# EAGLE design H1FR0 (EAGLE 8.6.3)

## Sheet 1 of 2
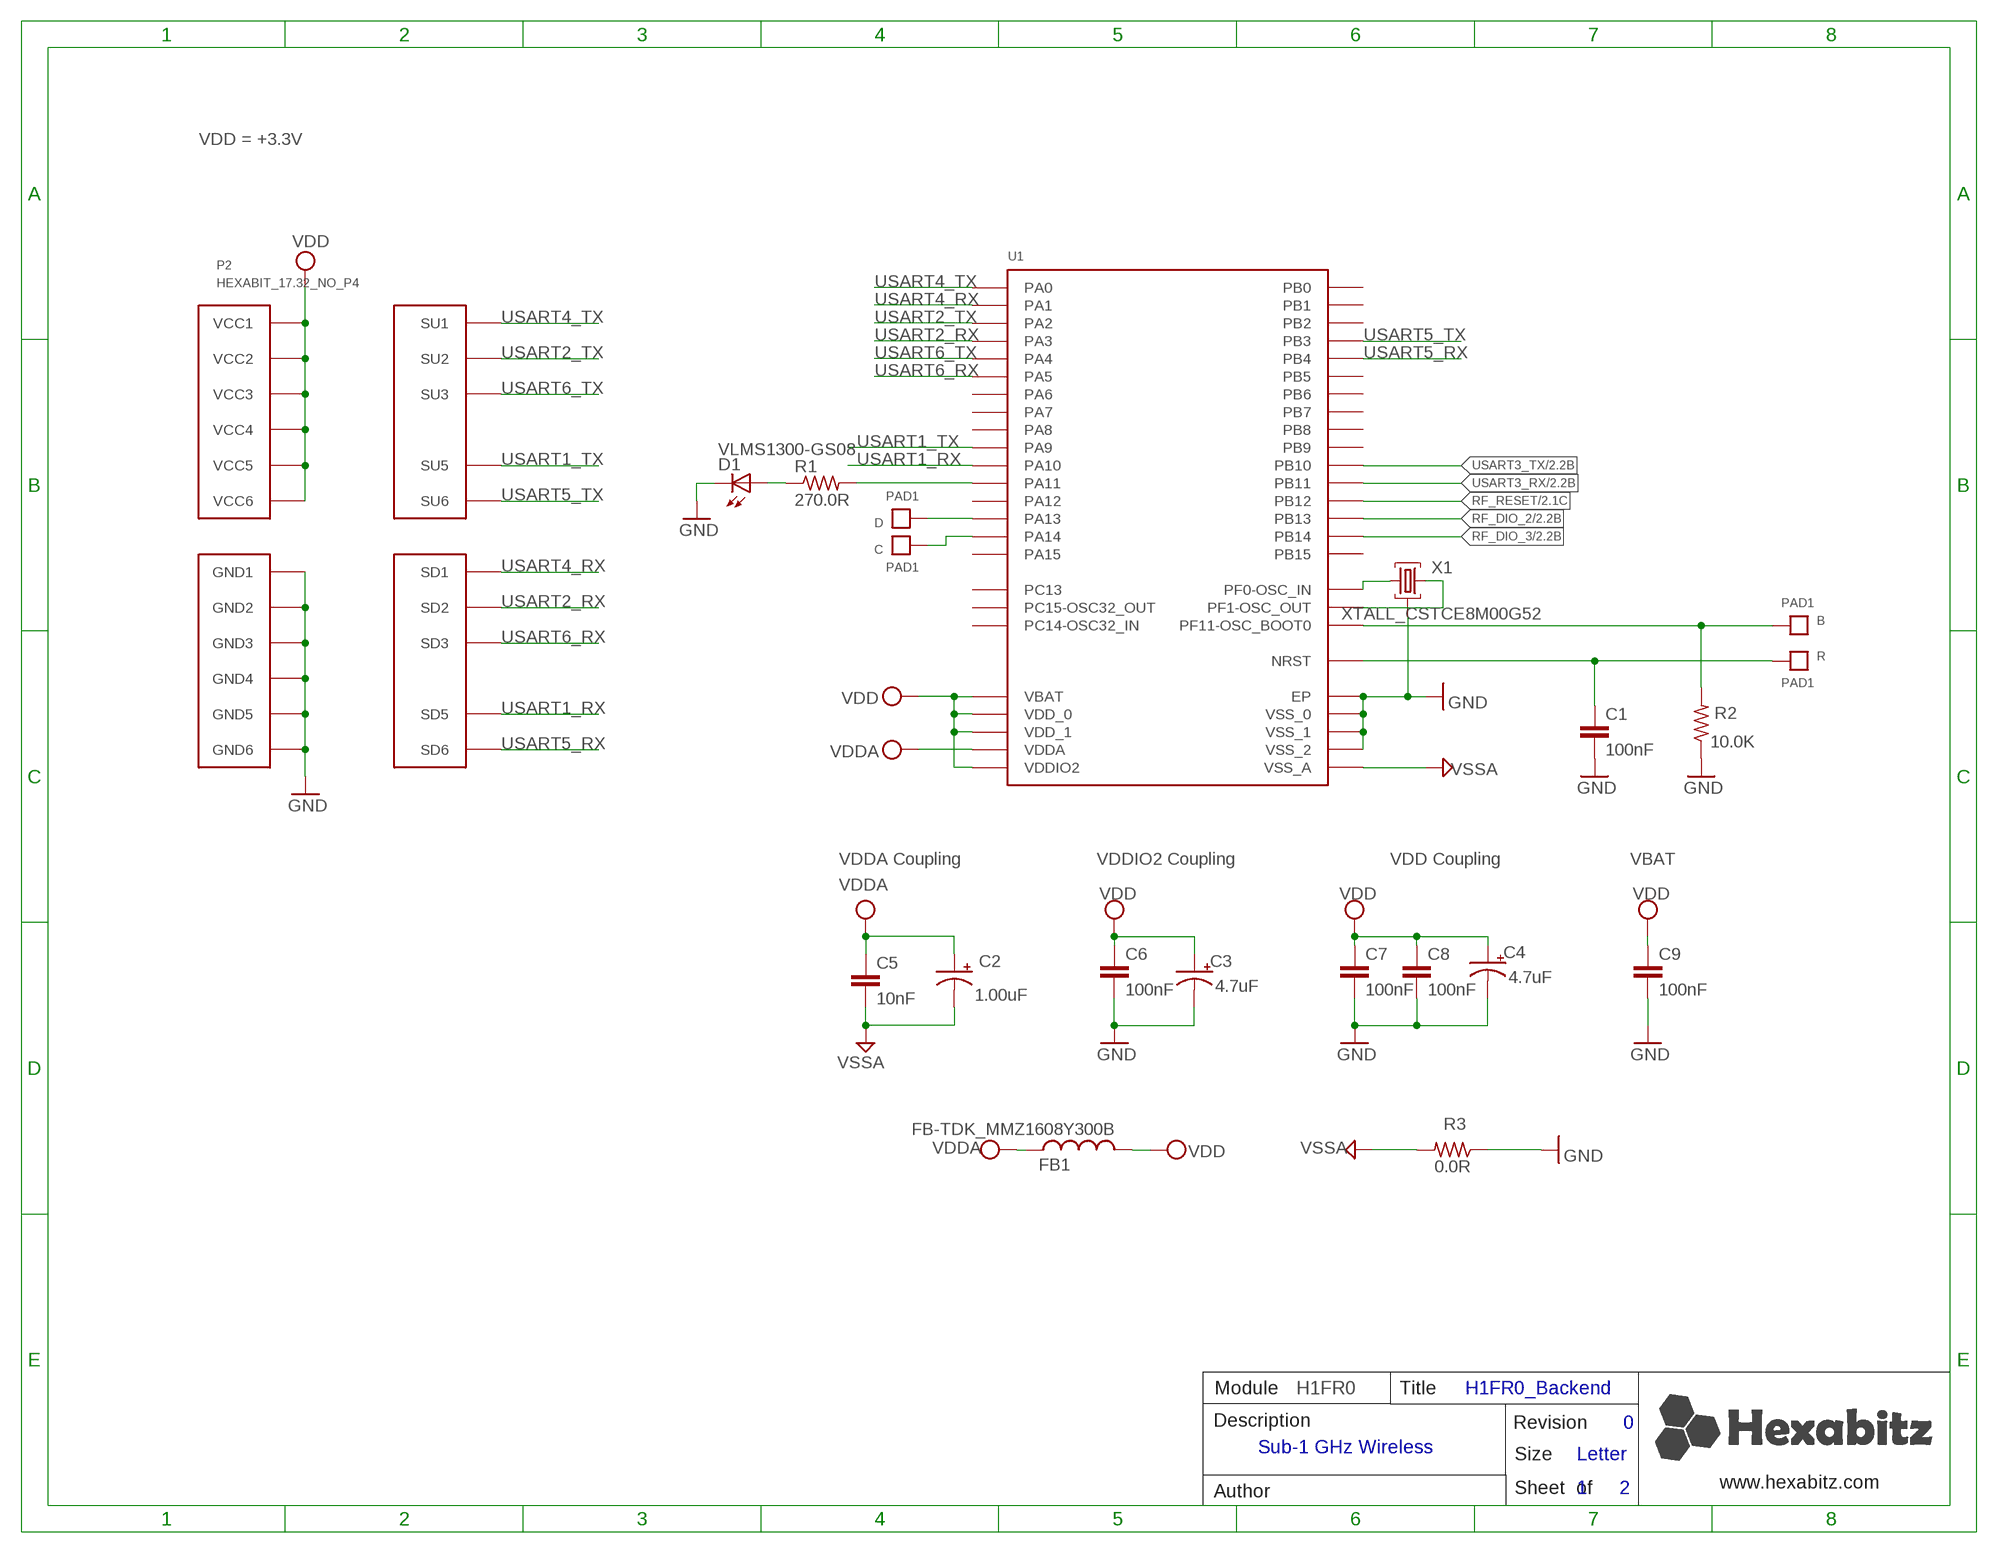
[diagram p0: schematic, sheet 1]

### Parts
B  PAD1  [PAD1]
C  PAD1  [PAD1]
C1  100nF  C-0603  [C-0603]
C2  1.00uF  C-0805  [C-0805]
C3  4.7uF  C-0805  [C-0805]
C4  4.7uF  C-0805  [C-0805]
C5  10nF  C-0603  [C-0603]
C6  100nF  C-0603  [C-0603]
C7  100nF  C-0603  [C-0603]
C8  100nF  C-0603  [C-0603]
C9  100nF  C-0603  [C-0603]
D  PAD1  [PAD1]
D1  VLMS1300-GS08  [VLMS1300-GS08]
FB1  FB-TDK_MMZ1608Y300B  [FB-TDK_MMZ1608Y300B]
P2  HEXABIT_17.32_NO_P4  [HEXABIT_17.32_NO_P4]
R  PAD1  [PAD1]
R1  270.0R  R-0603  [R-0603]
R2  10.0K  R-0603  [R-0603]
R3  0.0R  R-0603  [R-0603]
U1  STM32F091CBU6  [STM32F091CBU6]
X1  XTALL_CSTCE8M00G52  [XTALL_CSTCE8M00G52]

### Nets
B: B.P$1 B.P$2 R2.2 U1.P$44(PF11-OSC_BOOT0)
GND: C1.2 C3.2(-) C4.2(-) C6.2 C7.2 C8.2 C9.2 D1.C P2.7(GND1) P2.8(GND2) P2.9(GND3) P2.10(GND4) P2.11(GND5) P2.12(GND6) R2.1 R3.1 U1.EP U1.P$23(VSS_0) U1.P$35(VSS_1) U1.P$47(VSS_2) X1.P$2 ; also sheet 2
N$1: D.P$1 D.P$2 U1.P$34(PA13)
N$2: C.P$1 C.P$2 U1.P$37(PA14)
N$8: R1.2 U1.P$32(PA11)
N$10: D1.A R1.1
N$14: U1.P$5(PF0-OSC_IN) X1.P$1
N$15: U1.P$6(PF1-OSC_OUT) X1.P$3
R: C1.1 R.P$1 R.P$2 U1.P$7(NRST)
RF_DIO_2: U1.P$26(PB13) ; also sheet 2
RF_DIO_3: U1.P$27(PB14) ; also sheet 2
RF_RESET: U1.P$25(PB12) ; also sheet 2
USART1_RX: P2.23(SD5) U1.P$31(PA10)
USART1_TX: P2.17(SU5) U1.P$30(PA9)
USART2_RX: P2.20(SD2) U1.P$13(PA3)
USART2_TX: P2.14(SU2) U1.P$12(PA2)
USART3_RX: U1.P$22(PB11) ; also sheet 2
USART3_TX: U1.P$21(PB10) ; also sheet 2
USART4_RX: P2.19(SD1) U1.P$11(PA1)
USART4_TX: P2.13(SU1) U1.P$10(PA0)
USART5_RX: P2.25(SD6) U1.P$40(PB4)
USART5_TX: P2.18(SU6) U1.P$39(PB3)
USART6_RX: P2.21(SD3) U1.P$15(PA5)
USART6_TX: P2.15(SU3) U1.P$14(PA4)
VDD: C3.1(+) C4.1(+) C6.1 C7.1 C8.1 C9.1 FB1.2 P2.1(VCC1) P2.2(VCC2) P2.3(VCC3) P2.4(VCC4) P2.5(VCC5) P2.6(VCC6) U1.P$1(VBAT) U1.P$24(VDD_0) U1.P$36(VDDIO2) U1.P$48(VDD_1) ; also sheet 2
VDDA: C2.1(+) C5.1 FB1.1 U1.P$9(VDDA)
VSSA: C2.2(-) C5.2 R3.2 U1.P$8(VSS_A)
Unconnected: U1.P$2(PC13) U1.P$3(PC14-OSC32_IN) U1.P$4(PC15-OSC32_OUT) U1.P$16(PA6) U1.P$17(PA7) U1.P$18(PB0) U1.P$19(PB1) U1.P$20(PB2) U1.P$28(PB15) U1.P$29(PA8) U1.P$33(PA12) U1.P$38(PA15) U1.P$41(PB5) U1.P$42(PB6) U1.P$43(PB7) U1.P$45(PB8) U1.P$46(PB9)

### Notes on the sheet
- VDD = +3.3V
- VDDA Coupling | VDDIO2 Coupling | VDD Coupling | VBAT
- Module | H1FR0 | Title | H1FR0_Backend
- Description | Revision | 0
- Sub-1 GHz Wireless
- Size | Letter
- www.hexabitz.com
- Author | Sheet  of | 1 | 2
- C:/Users/Admin/Desktop/logodraft.bmp

## Sheet 2 of 2
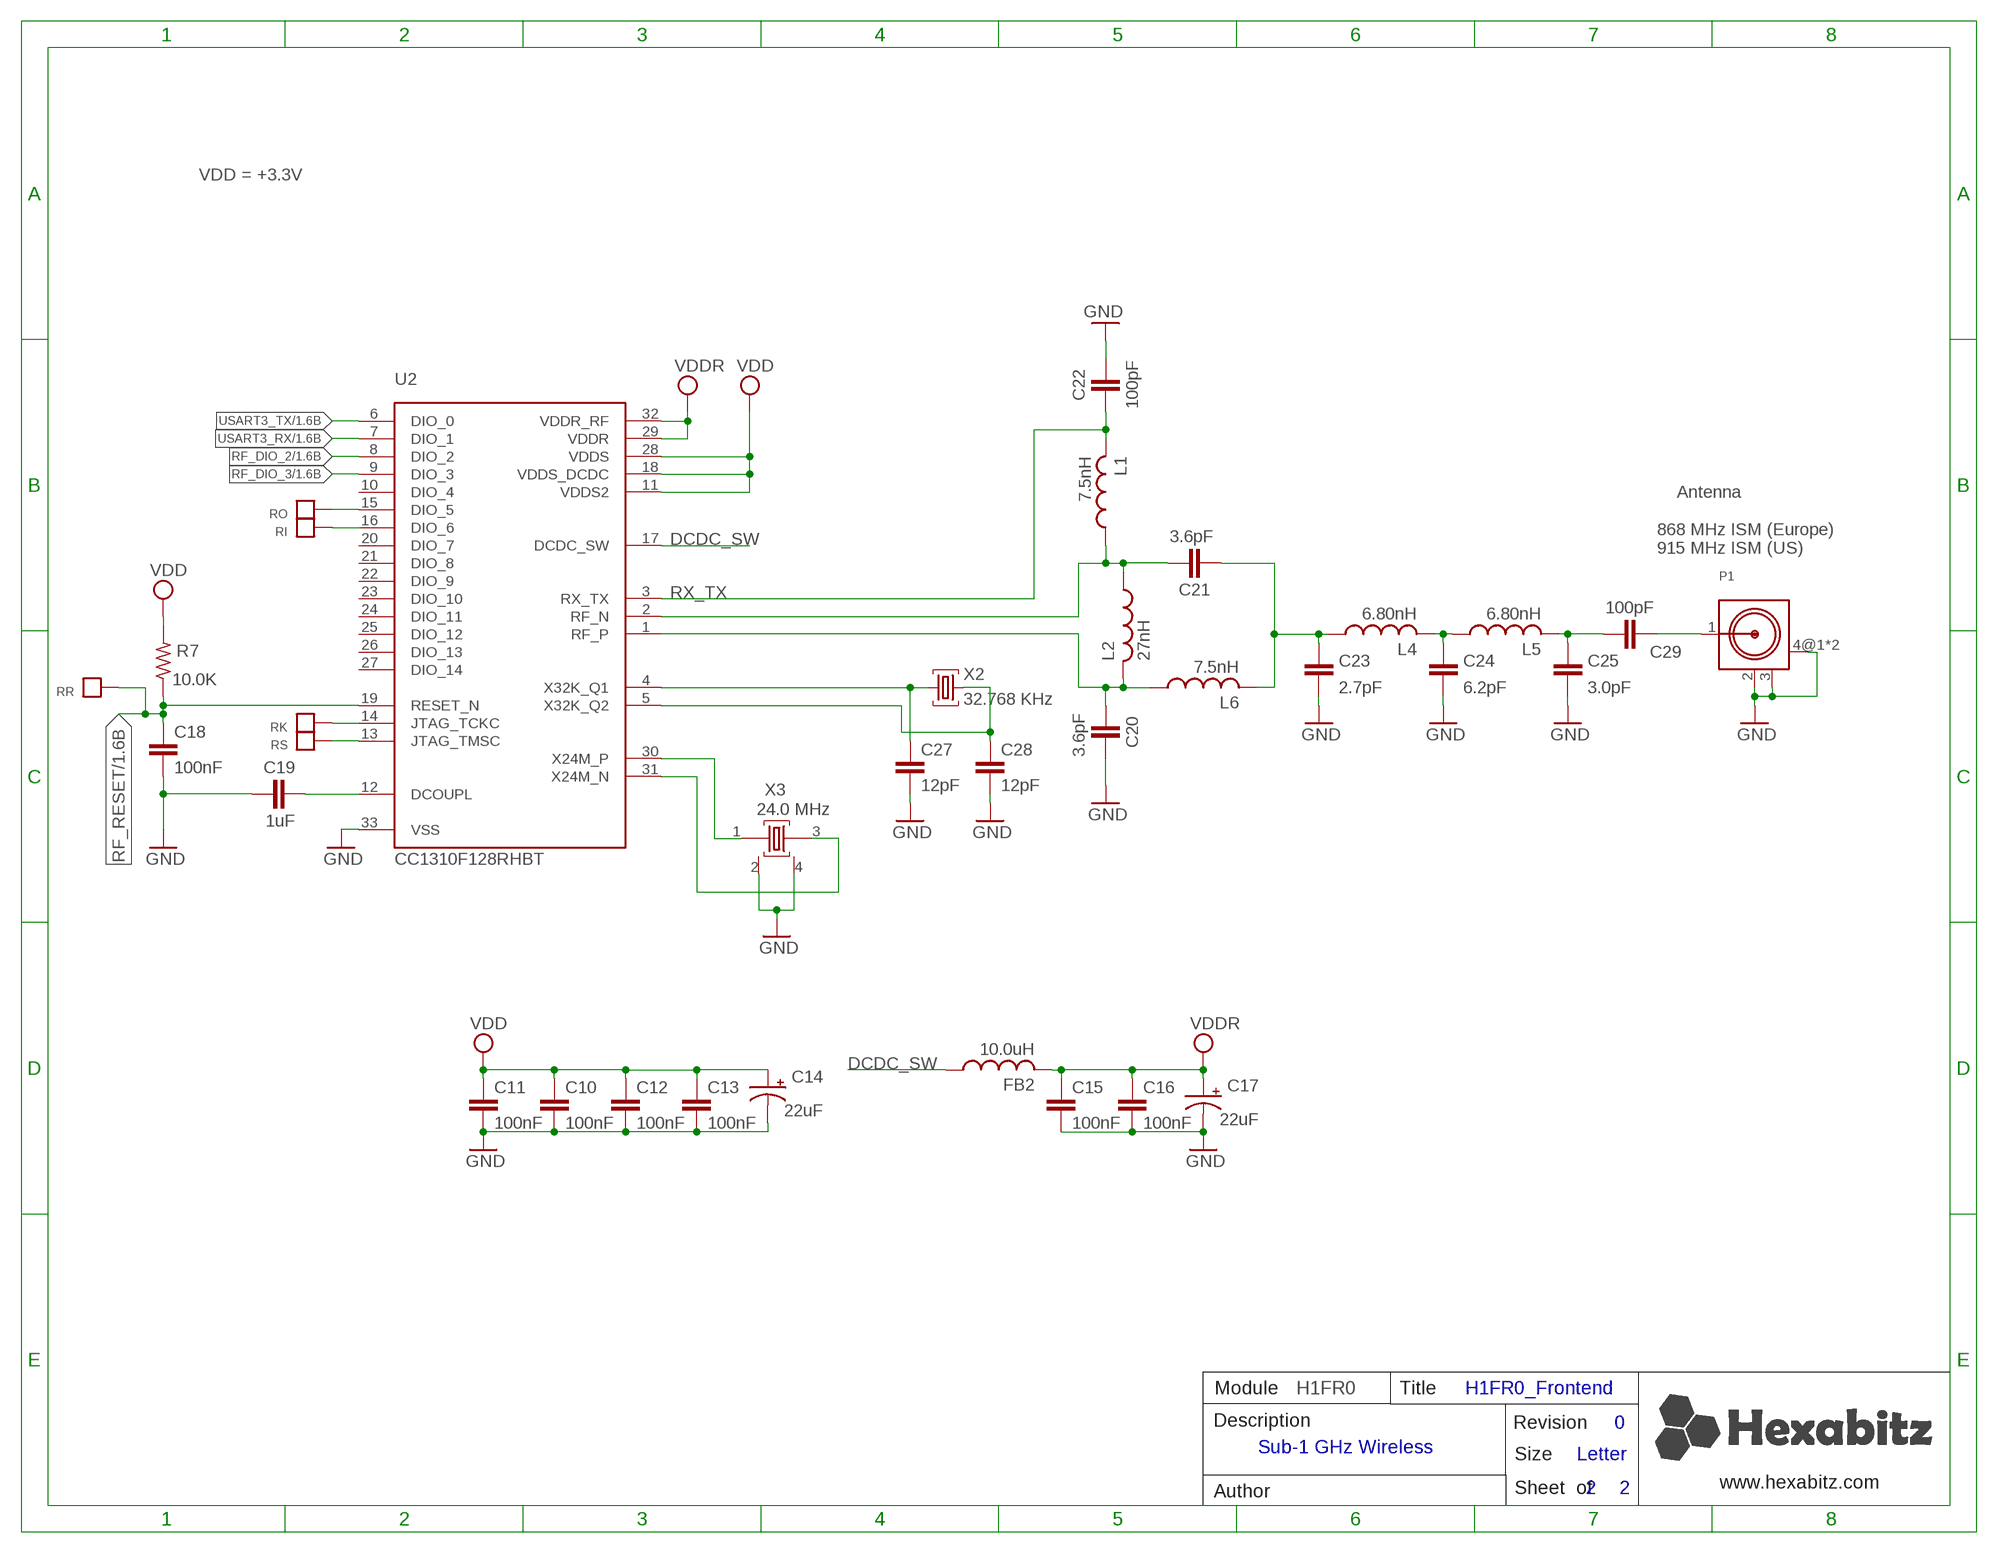
[diagram p1: schematic, sheet 2]

### Parts
C10  100nF  C-0402  [C-0402]
C11  100nF  C-0402  [C-0402]
C12  100nF  C-0402  [C-0402]
C13  100nF  C-0402  [C-0402]
C14  22uF  C-0805  [C-0805]
C15  100nF  C-0402  [C-0402]
C16  100nF  C-0402  [C-0402]
C17  22uF  C-0805  [C-0805]
C18  100nF  C-0402  [C-0402]
C19  1uF  C-0603  [C-0603]
C20  3.6pF  C-0402  [C-0402]
C21  3.6pF  C-0402  [C-0402]
C22  100pF  C-0402  [C-0402]
C23  2.7pF  C-0402  [C-0402]
C24  6.2pF  C-0402  [C-0402]
C25  3.0pF  C-0402  [C-0402]
C27  12pF  C-0603  [C-0603]
C28  12pF  C-0603  [C-0603]
C29  100pF  C-0402  [C-0402]
FB2  10.0uH  FB-0805  [FB-0805]
L1  7.5nH  IND-0402  [IND-0402]
L2  27nH  IND-0402  [IND-0402]
L4  6.80nH  IND-0402  [IND-0402]
L5  6.80nH  IND-0402  [IND-0402]
L6  7.5nH  IND-0402  [IND-0402]
P1  5-1814400-1  [5-1814400-1]
R7  10.0K  R-0603  [R-0603]
RI  PAD4  [PAD4]
RK  PAD4  [PAD4]
RO  PAD4  [PAD4]
RR  PAD4  [PAD4]
RS  PAD4  [PAD4]
U2  CC1310F128RHBT  [CC1310F128RHBT]
X2  32.768 KHz  XTALL_FC-12M  [XTALL_FC-12M]
X3  24.0 MHz  XTALL_TXS-3225-24.0000M  [XTALL_TXS-3225-24.0000M]

### Nets
DCDC_SW: FB2.1 U2.17(DCDC_SW)
GND: C10.2 C11.2 C12.2 C13.2 C14.2(-) C15.2 C16.2 C17.2(-) C18.2 C19.1 C20.2 C22.2 C23.1 C24.1 C25.1 C27.2 C28.2 P1.2 P1.3 P1.4@1 P1.4@2 U2.33(VSS) X3.2 X3.4 ; also sheet 1
N$3: RO.P$1 U2.15(DIO_5)
N$5: C21.1 C23.2 L4.1 L6.2
N$6: C19.2 U2.12(DCOUPL)
N$7: RK.P$1 U2.14(JTAG_TCKC)
N$9: RS.P$1 U2.13(JTAG_TMSC)
N$11: C24.2 L4.2 L5.1
N$12: C25.2 C29.2 L5.2
N$13: C29.1 P1.1
N$16: C27.1 U2.4(X32K_Q1) X2.P$2
N$17: C28.1 U2.5(X32K_Q2) X2.P$1
N$18: U2.30(X24M_P) X3.1
N$19: U2.31(X24M_N) X3.3
N$20: RI.P$1 U2.16(DIO_6)
N$22: C21.2 L1.1 L2.1 U2.2(RF_N)
N$24: C20.1 L2.2 L6.1 U2.1(RF_P)
RF_DIO_2: U2.8(DIO_2) ; also sheet 1
RF_DIO_3: U2.9(DIO_3) ; also sheet 1
RF_RESET: C18.1 R7.1 RR.P$1 U2.19(RESET_N) ; also sheet 1
RX_TX: C22.1 L1.2 U2.3(RX_TX)
USART3_RX: U2.7(DIO_1) ; also sheet 1
USART3_TX: U2.6(DIO_0) ; also sheet 1
VDD: C10.1 C11.1 C12.1 C13.1 C14.1(+) R7.2 U2.11(VDDS2) U2.18(VDDS_DCDC) U2.28(VDDS) ; also sheet 1
VPP: C15.1 C16.1 C17.1(+) FB2.2 U2.29(VDDR) U2.32(VDDR_RF) ; supply symbol labelled VDDR
Unconnected: U2.10(DIO_4) U2.20(DIO_7) U2.21(DIO_8) U2.22(DIO_9) U2.23(DIO_10) U2.24(DIO_11) U2.25(DIO_12) U2.26(DIO_13) U2.27(DIO_14)

### Notes on the sheet
- VDD = +3.3V
- Antenna
  
  868 MHz ISM (Europe)
  915 MHz ISM (US)
- Module | H1FR0 | Title | H1FR0_Frontend
- Description | Revision | 0
- Sub-1 GHz Wireless
- Size | Letter
- www.hexabitz.com
- Author | Sheet  of | 2 | 2
- C:/Users/Admin/Desktop/logodraft.bmp

## Library data of the parts
B C D R = Hexabitz:PAD1
C1 C6 C8 = Hexabitz:C-0603: CAP CER 10% X7R 0603; CAPACITANCE: 100nF; MFN: KEMET; MPN: C0603C104K8RACTU; OCTOPART_URL: https://octopart.com/c0603c104k8ractu-kemet-145075?r=sp&s=9bS9ASSwSEqMCE9KBEQZ0g; TOLERANCE: 10%; VOLTAGE_RATING: 10V
C2 = Hexabitz:C-0805: Cap Tant Solid SMD 2012; CAPACITANCE: 1.00uF; MFN: Yageo; MPN: CC0805KKX7R7BB105; OCTOPART_URL: https://octopart.com/cc0805kkx7r7bb105-yageo-8376555?r=sp&s=YKl1wwtkROau_X5nniH2ig; TOLERANCE: 10%; VOLTAGE_RATING: 16V
C3 C4 = Hexabitz:C-0805: Cap Tant Solid SMD 2012; CAPACITANCE: 4.7uF; MFN: Murata; MPN: GRM21BC81E475KA12L; OCTOPART_URL: https://octopart.com/grm21bc81e475ka12l-murata-10331911?r=sp&s=RY3qZSD8T6mG6TC9CHI5qQ; TOLERANCE: 10%; VOLTAGE_RATING: 25V
C5 = Hexabitz:C-0603: CAP CER 10% X7R 0603; CAPACITANCE: 10nF; MFN: KEMET; MPN: C0603C103K5RACTU; OCTOPART_URL: https://octopart.com/c0603c103k5ractu-kemet-133094?r=sp&s=R_iPBxLnSmGqhkU2rIMFpg; TOLERANCE: 10%; VOLTAGE_RATING: 50V
C7 = Hexabitz:C-0603: CAP CER 10% X7R 0603; CAPACITANCE: 100nF; MFN: KEMET; MPN: C0603C104K8RACTU; OCTOPART_URL: https://octopart.com/c0603c104k8ractu-kemet-145075?r=sp&s=9bS9ASSwSEqMCE9KBEQZ0g; TOLERANCE: 10%; VOLTAGE_RATING: 10
C9 = Hexabitz:C-0603: CAP CER 10% X7R 0603; CAPACITANCE: 100nF; MFN: KEMET; MPN: C0603C104K8RACTU; OCTOPART_URL: https://octopart.com/c0603c104k8ractu-kemet-145075?r=sp&s=9bS9ASSwSEqMCE9KBEQZ0g; TOLERANCE: 10V; VOLTAGE_RATING: 10%
C10-C13 C15 C16 C18 = Hexabitz:C-0402: CAP CER 10% 0402; MFN: Murata; MPN: GRM155R70J104KA01D; OCTOPART_URL: https://octopart.com/grm155r70j104ka01d-murata-17930200; TOLERANCE: ±10%; VOLTAGE_RATING: 6.3 V
C14 C17 = Hexabitz:C-0805: Cap Tant Solid SMD 2012; CAPACITANCE: 22uF; MFN: Yageo; MPN: CC0805KKX5R5BB226; OCTOPART_URL: https://octopart.com/search?q=CC0805KKX5R5BB226&start=0; TOLERANCE: 10%; VOLTAGE_RATING: 6.3V
C19 = Hexabitz:C-0603: CAP CER 10% X7R 0603; CAPACITANCE: 1uF; MFN: Murata; MPN: GRM188R70J105KA01D; OCTOPART_URL: https://octopart.com/grm188r70j105ka01d-murata-197450; TOLERANCE: 10%; VOLTAGE_RATING: 6.3V
C20 = Hexabitz:C-0402: CAP CER 10% 0402; MFN: Murata; MPN: GRM1555C1H3R6CA01D; OCTOPART_URL: https://octopart.com/grm1555c1h3r6ca01d-murata-18814425; TOLERANCE: ±0.25pF; VOLTAGE_RATING: 50 V
C21 = Hexabitz:C-0402: CAP CER 10% 0402; MFN: Murata; MPN: GRM1555C1H3R6CA01D; OCTOPART_URL: https://octopart.com/grm1555c1h3r6ca01d-murata-18814425; TOLERANCE: ±0.25%; VOLTAGE_RATING: 50 V
C22 C29 = Hexabitz:C-0402: CAP CER 10% 0402; MFN: Murata; MPN: GRM1555C1H101JA01D; OCTOPART_URL: https://octopart.com/grm1555c1h101ja01d-murata-15197512; TOLERANCE: ±5%; VOLTAGE_RATING: 50V
C23 = Hexabitz:C-0402: CAP CER 10% 0402; MFN: Murata; MPN: GRM1555C1H2R7CA01D; OCTOPART_URL: https://octopart.com/search?q=GRM1555C1H2R7CA01D&start=0; TOLERANCE: ±0.25 pF; VOLTAGE_RATING: 50 V
C24 = Hexabitz:C-0402: CAP CER 10% 0402; MFN: Murata; MPN: GRM1555C1H6R2CA01D; OCTOPART_URL: https://octopart.com/search?q=GRM1555C1H6R2CA01D&start=0; TOLERANCE: ±0.25pF; VOLTAGE_RATING: 50 V
C25 = Hexabitz:C-0402: CAP CER 10% 0402; MFN: Murata; MPN: GRM1555C1H3R0CA01D; OCTOPART_URL: https://octopart.com/search?q=GRM1555C1H3R0CA01D&start=0; TOLERANCE: ±0.25 pF; VOLTAGE_RATING: 50 V
C27 C28 = Hexabitz:C-0603: CAP CER 10% X7R 0603; CAPACITANCE: 12pF; MFN: AVX; MPN: 06035A120JAT2A; OCTOPART_URL: https://octopart.com/06035a120jat2a-avx-194785; TOLERANCE: 5%; VOLTAGE_RATING: 50V
D1 = Hexabitz:VLMS1300-GS08: Red 0603 130° Clear 54 mcd 2 V Surface Mount ChipLED ; Octopart Url : http://octopart.com/vlms1300-gs08-vishay-21709201; MFN: Vishay; MPN: VLMS1300-GS08; OCTOPART_URL: https://octopart.com/vlms1300-gs08-vishay-21709201?r=sp&s=_gcP4_q8T1SC6PJQPTQ9yA
FB1 = Hexabitz:FB-TDK_MMZ1608Y300B: Ferrite Beads Multi-Layer 30Ohm 25% 100MHz 1.5A 50mOhm DCR 0603; MFN: TDK; MPN: MMZ1608Y300B; OCTOPART_URL: https://octopart.com/mmz1608y300b-tdk-368280?r=sp&s=cd9_2ZEqQ9q9UNBuQgHAiA
FB2 = Hexabitz:FB-0805: Ferrite Beads Multi-Layer 0805; MFN: Taiyo Yuden; MPN: CKS2125100M-T; OCTOPART_URL: http://octopart.com/cks2125100m-t-taiyo+yuden-18605517
L1 L6 = Hexabitz:IND-0402: Inductor - SMD 0402; INDUCTANCE: 7.5nH; MFN: Murata; MPN: LQG15HS7N5J02D; OCTOPART_URL: https://octopart.com/search?q=LQG15HS7N5J02D&start=0
L2 = Hexabitz:IND-0402: Inductor - SMD 0402; INDUCTANCE: 27nH; MFN: Murata; MPN: LQG15HS27NJ02D; OCTOPART_URL: https://octopart.com/search?q=LQG15HS27NJ02D&start=0
L4 L5 = Hexabitz:IND-0402: Inductor - SMD 0402; INDUCTANCE: 6.80nH; MFN: Murata; MPN: LQW15AN6N8G00D; OCTOPART_URL: https://octopart.com/lqw15an6n8g00d-murata-7896134
P1 = Hexabitz:5-1814400-1: CONN SMA JACK R/A 50 OHM PCB; MFN: TE Connectivity; MPN: 5-1814400-1; OCTOPART_URL: https://octopart.com/search?q=5-1814400-1&oq=5-1814400-1&start=0
P2 = Hexabitz:HEXABIT_17.32_NO_P4: HEXABIT CONNECTOR
R1 = Hexabitz:R-0603: Thick Film Resistors - SMD 0603; MFN: Yageo; MPN: RC0603FR-07270RL; OCTOPART_URL: https://octopart.com/search?q=RC0603FR-07270RL&start=0; RESISTANCE: 270.0 Ohm; TOLERANCE: 1%
R2 R7 = Hexabitz:R-0603: Thick Film Resistors - SMD 0603; MFN: Yageo; MPN: RC0603JR-0710KL; OCTOPART_URL: https://octopart.com/search?q=RC0603JR-0710KL&start=0; RESISTANCE: 10.0K Ohm; TOLERANCE: 5%
R3 = Hexabitz:R-0603: Thick Film Resistors - SMD 0603; MFN: Yageo; MPN: RC0603JR-070RL; OCTOPART_URL: https://octopart.com/rc0603jr-070rl-yageo-1241539?r=sp&s=X2NteqRjRNWrnx42Y0aliA; RESISTANCE: 0.0 Ohm
RI RK RO RR RS = Hexabitz:PAD4
U1 = Hexabitz:STM32F091CBU6: Description : ARM-based 32-bit MCU, CAN, 12 timers, ADC, DAC & Comm. Interface, 2 to 3.6 V, -40 to 85 degC, 48-Pin UFQFPN, RoHS, Tray ;Parameter : Ciiva URL : https://ciiva.com/part/STM32F091CBU6-20240708, CiivaID : 20240708, Clock Speed : 48000000.0 Hz, Lifecycle Status : Active, Mounting Style : Surface Mount, Number of Pins : 48, Octopart Url : https://octopart.com/stm32f091cbu6-stmicroelectronics-51988677, OctopartID : 5f4f955c32ec8088, RAM Memory Size : 32768 B, REACH SVHC Compliance : No SVHC, RoHS : Compliant,; MFN: STMicroelectronics; MPN: STM32F091CBU6; OCTOPART_URL: https://octopart.com/stm32f091cbu6-stmicroelectronics-51988677?r=sp&s=bU6fpgsrTZOxHyt7jkfh3w
U2 = Hexabitz:CC1310F128RHBT: Description : SimpleLink Sub-1 GHz Ultra-Low Power Wireless Microcontroller 32-VQFN -40 to 85 Parameter : Core Architecture : ARM Current - Receiving : 5.5 mA Current - Transmitting : 22.6 mA Data Bus Width : 32 b Data Rate : 50 kbps Density : 131072 B Frequency : 930 MHz Interface : I2C , SPI , UART , I2S Max Frequency : 1 GHz Max Operating Temperature : 85 °C Max Supply Voltage : 3.8 V Memory Size : 20 kB Memory Type : FLASH Min Operating Temperature : -40 °C Min Supply Voltage : 1.8 V Number of GPIO : 15 Number of Programmable I/O : 15 Number of Timers/Counters : 4 RAM Size : 20 kb Sensitivity : -124 dBm Watchdog Timer : Yes; MFN: Texas Instruments; MPN: CC1310F128RHBT; OCTOPART_URL: http://octopart.com/cc1310f128rhbt-texas+instruments-65758956
X1 = Hexabitz:XTALL_CSTCE8M00G52: MURATA CSTCE8M00G52-R0 RESONATOR, SMD, 8MHZ ; Octopart Url : https://octopart.com/cstce8m00g52-r0-murata-7145559; MFN: Murata; MPN: CSTCE8M00G52Z-R0; OCTOPART_URL: https://octopart.com/cstce8m00g52z-r0-murata-17755941?r=sp&s=JDnNJnrHQhyS8Zk4ofFWXw
X2 = Hexabitz:XTALL_FC-12M: CRYSTAL 32.7680KHZ 12.5PF SMD; MFN: EPSON; MPN: FC-12M 32.7680KA-A3; OCTOPART_URL: https://octopart.com/fc-12m+32.7680ka-a3-epson-44407702
X3 = Hexabitz:XTALL_TXS-3225-24.0000M: TSX-3225 Series 24 MHz ±10 ppm 9 pF -40 to +105°C Surface Mount Crystal Unit; MFN: EPSON; MPN: TSX-3225 24.0000MF20G-AC3; OCTOPART_URL: https://octopart.com/tsx-3225+24.0000mf20g-ac3-epson-44407675

## Board
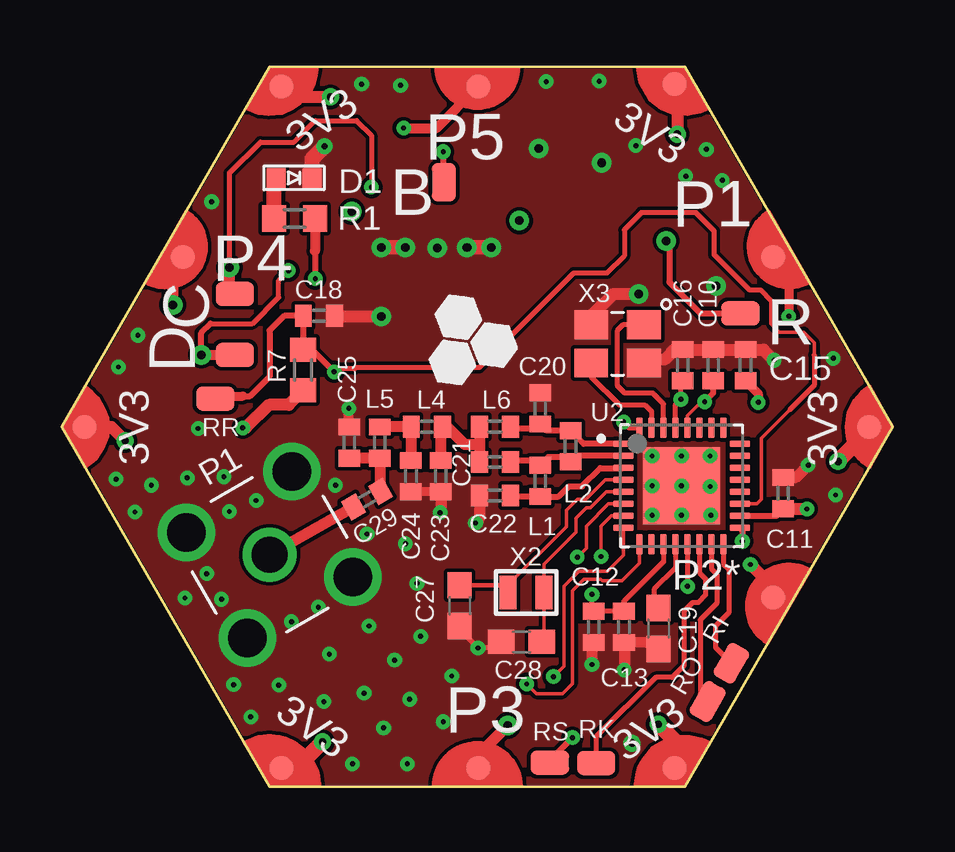
[diagram p2: board, top side]
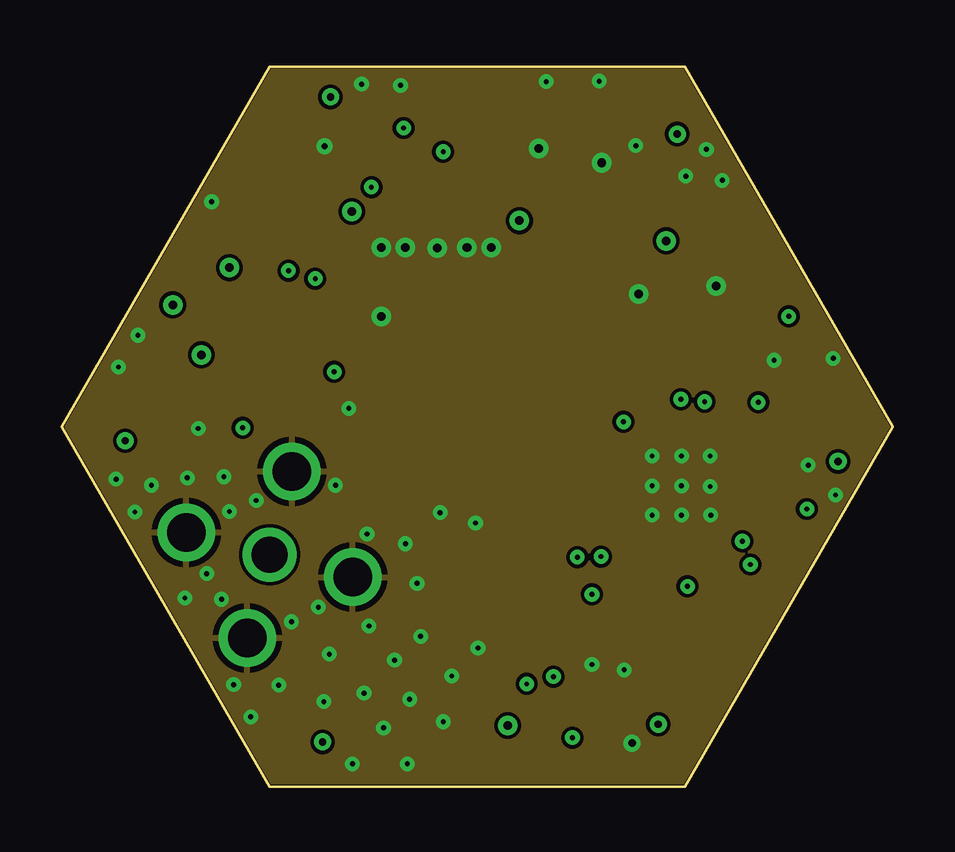
[diagram p3: board, inner layer Route2]
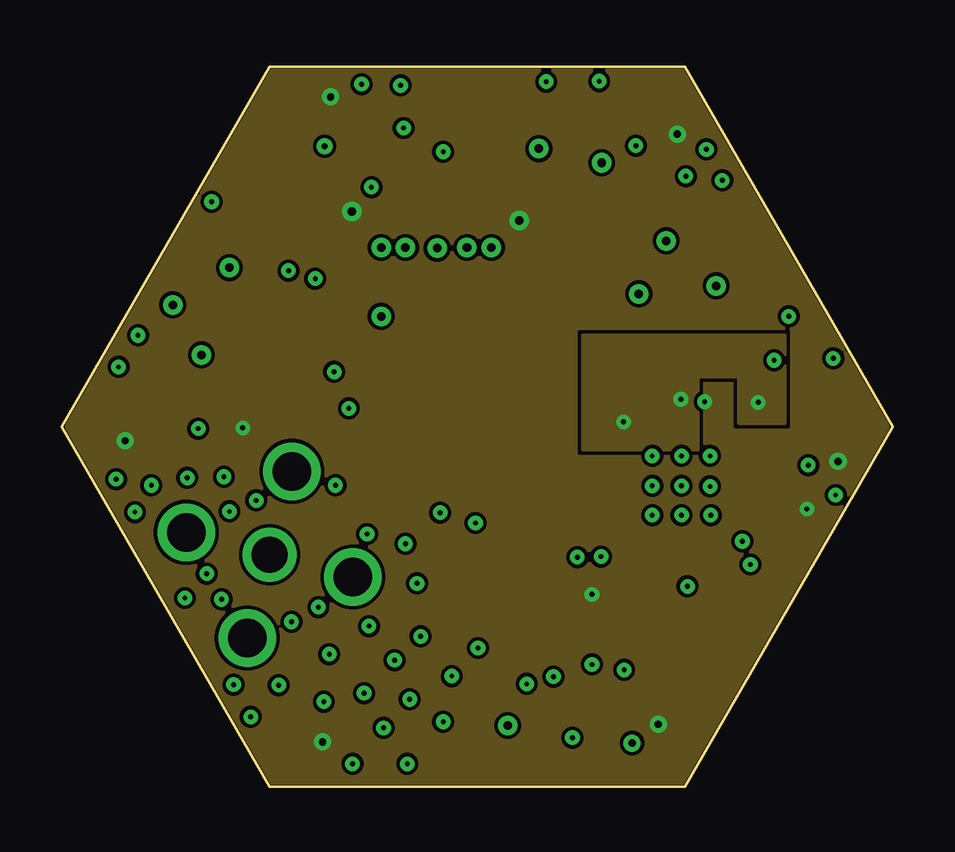
[diagram p4: board, inner layer Route15]
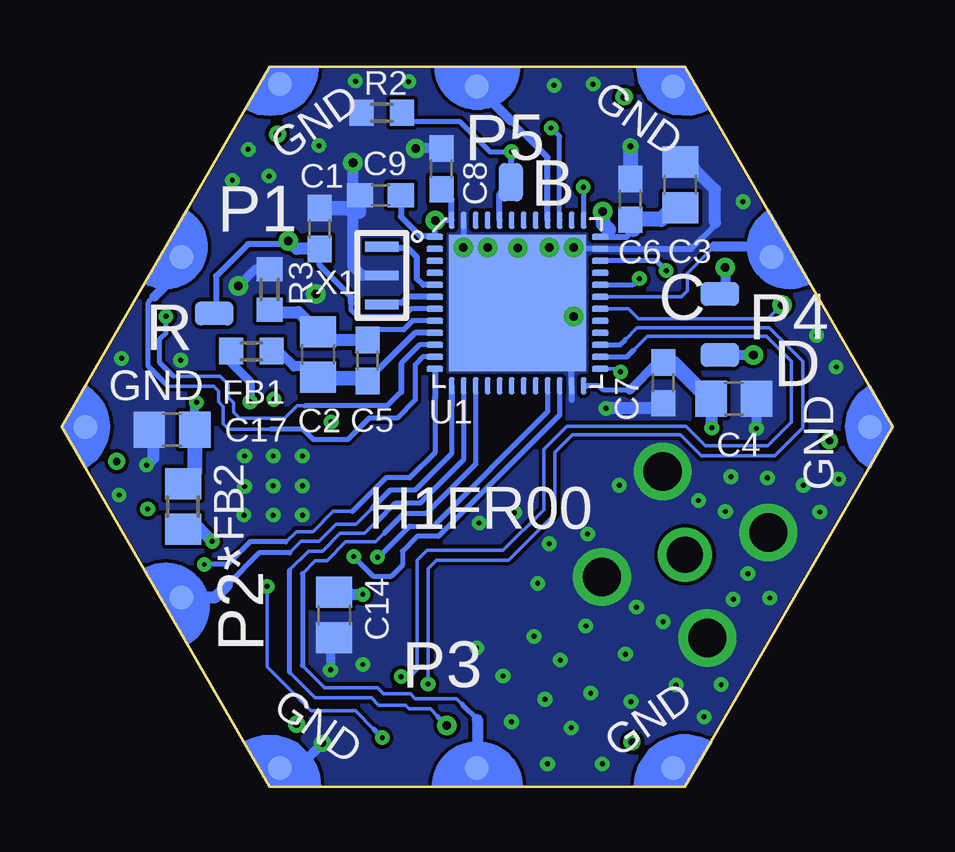
[diagram p5: board, bottom side, seen from below]

Size 34.64 x 30 mm. Coordinates in mm from the lower left corner, seen from the top.
Copper layers (1*2+15*16): Top 0.035mm / dielectric 0.175mm / Route2 0.035mm / dielectric 1.11mm / Route15 0.035mm / dielectric 0.175mm / Bottom 0.035mm
Design rules "default *": minimum track width 6mil, minimum drill 8mil, track to track 6mil, track to pad 6mil, pad to pad 6mil, via to via 6mil, smd to smd 0mil, copper to edge 1mil, drill to drill 8mil, minimum pad ring 10mil, minimum via ring 8mil, stop-mask expansion 2mil, vias tented up to drill 15mil, thermal gap 10mil

### Footprints (pad centres in the part's own frame; a part is rotated, then mirrored left to right if it is on the bottom)
PAD1 = smd 1.6 x 1: P$1 0,0 | smd 1.6 x 1 bottom: P$2 0,0
C-0603 = smd 1.1 x 1: 1 -0.85,0; 2 0.85,0
C-0805 = smd 1.3 x 1.5: 1 -0.95,0; 2 0.95,0
C-0402 = smd 0.7 x 0.9: 1 -0.65,0; 2 0.65,0
VLMS1300-GS08 = smd 0.8 x 0.8: A 0,0.75; C 0,-0.75
FB-TDK_MMZ1608Y300B = smd 1 x 1.1: 1 -0.85,0; 2 0.85,0
FB-0805 = smd 1.3 x 1.5: 1 -0.95,0; 2 0.95,0
IND-0402 = smd 0.7 x 0.9: 1 -0.65,0; 2 0.65,0
5-1814400-1 = drill 1.5: 1 0,0 | drill 1.6: 2 -2.54,-2.54; 3 2.54,-2.54; 4@1 -2.54,2.54; 4@2 2.54,2.54
HEXABIT_17.32_NO_P4 = smd 1 x 1: 1 8.23,14.28; 2 16.33,-0.02; 3 8.23,-14.22; 4 -8.17,-14.22; 5 -16.37,-0.02; 6 -8.17,14.18; 13 12.33,7.08; 14 12.33,-7.12; 15 0.03,-14.22; 17 -12.27,7.08; 18 0.03,14.18 | smd 1 x 1 bottom: 7 8.23,14.28; 8 16.33,-0.02; 9 8.23,-14.22; 10 -8.17,-14.22; 11 -16.37,-0.02; 12 -8.17,14.18; 19 12.33,7.08; 20 12.33,-7.12; 21 0.03,-14.22; 23 -12.27,7.08; 25 0.03,14.18
R-0603 = smd 1 x 1.1: 1 -0.85,0; 2 0.85,0
PAD4 = smd 1.6 x 1: P$1 0,0
STM32F091CBU6 = smd 5.7 x 5.7: EP 0,0 | smd 0.25 x 0.7: P$1 -2.75,-3.45; P$2 -2.25,-3.45; P$3 -1.75,-3.45; P$4 -1.25,-3.45; P$5 -0.75,-3.45; P$6 -0.25,-3.45; P$7 0.25,-3.45; P$8 0.75,-3.45; P$9 1.25,-3.45; P$10 1.75,-3.45; P$11 2.25,-3.45; P$12 2.75,-3.45; P$25 2.75,3.45; P$26 2.25,3.45; P$27 1.75,3.45; P$28 1.25,3.45; P$29 0.75,3.45; P$30 0.25,3.45; P$31 -0.25,3.45; P$32 -0.75,3.45; P$33 -1.25,3.45; P$34 -1.75,3.45; P$35 -2.25,3.45; P$36 -2.75,3.45 | smd 0.7 x 0.25: P$13 3.45,-2.75; P$14 3.45,-2.25; P$15 3.45,-1.75; P$16 3.45,-1.25; P$17 3.45,-0.75; P$18 3.45,-0.25; P$19 3.45,0.25; P$20 3.45,0.75; P$21 3.45,1.25; P$22 3.45,1.75; P$23 3.45,2.25; P$24 3.45,2.75; P$37 -3.45,2.75; P$38 -3.45,2.25; P$39 -3.45,1.75; P$40 -3.45,1.25; P$41 -3.45,0.75; P$42 -3.45,0.25; P$43 -3.45,-0.25; P$44 -3.45,-0.75; P$45 -3.45,-1.25; P$46 -3.45,-1.75; P$47 -3.45,-2.25; P$48 -3.45,-2.75
CC1310F128RHBT = smd 0.86 x 0.27: 1 -2.425,1.75; 2 -2.425,1.25; 3 -2.425,0.75; 4 -2.425,0.25; 5 -2.425,-0.25; 6 -2.425,-0.75; 7 -2.425,-1.25; 8 -2.425,-1.75; 17 2.425,-1.75; 18 2.425,-1.25; 19 2.425,-0.75; 20 2.425,-0.25; 21 2.425,0.25; 22 2.425,0.75; 23 2.425,1.25; 24 2.425,1.75 | smd 0.27 x 0.86: 9 -1.75,-2.425; 10 -1.25,-2.425; 11 -0.75,-2.425; 12 -0.25,-2.425; 13 0.25,-2.425; 14 0.75,-2.425; 15 1.25,-2.425; 16 1.75,-2.425; 25 1.75,2.425; 26 1.25,2.425; 27 0.75,2.425; 28 0.25,2.425; 29 -0.25,2.425; 30 -0.75,2.425; 31 -1.25,2.425; 32 -1.75,2.425 | smd 3.2 x 3.2: 33 0,0
XTALL_CSTCE8M00G52 = smd 1.4 x 0.4: P$1 0,1.2; P$2 0,0; P$3 0,-1.2
XTALL_FC-12M = smd 0.7 x 1.4: P$1 -0.75,0; P$2 0.75,0
XTALL_TXS-3225-24.0000M = smd 1.4 x 1.2: 1 -1.1,-0.8; 2 1.1,-0.8; 3 1.1,0.8; 4 -1.1,0.8

### Placement (x,y rotation side)
B  15.92,25.19 270 top
C  7.21,20.54 0 top
C1  23.89,23.25 90 bottom
C2  23.96,18.01 90 bottom
C3  8.86,25.08 90 bottom
C4  6.63,16.17 0 bottom
C5  21.89,17.76 90 bottom
C6  10.94,24.47 90 bottom
C7  9.57,16.83 270 bottom
C8  18.82,25.74 90 bottom
C9  21.36,24.65 180 bottom
C10  27.15,17.57 90 top
C11  30.07,12.23 90 top
C12  22.17,6.66 270 top
C13  23.43,6.66 270 top
C14  23.29,7.15 270 bottom
C15  28.5,17.57 90 top
C16  25.88,17.57 90 top
C17  30.05,14.87 180 bottom
C18  10.72,19.62 0 top
C19  24.88,6.59 90 top
C20  19.94,15.76 90 top
C21  18.06,13.53 0 top
C22  18.06,12.13 180 top
C23  15.8,12.94 90 top
C24  14.55,12.94 90 top
C25  11.99,14.34 270 top
C27  16.58,7.55 270 top
C28  19.16,6.03 180 top
C29  12.72,11.98 30 top
D  7.21,18 0 top
D1  9.67,25.36 90 top
FB1  26.74,18.15 180 bottom
FB2  29.59,11.67 90 bottom
L1  19.94,12.74 270 top
L2  21.21,14.19 90 top
L4  15.21,15 180 top
L5  13.26,14.34 270 top
L6  18.06,15 180 top
P1  8.66,9.67 300 top
P2  17.32,15 0 top
R  28.29,19.72 0 top
R1  9.7,23.67 0 top
R2  21.3,28.08 0 bottom
R3  25.98,20.71 270 bottom
R7  10.06,17.36 270 top
RI  27.91,5.14 60 top
RK  22.27,0.98 0 top
RO  26.92,3.54 60 top
RR  6.4,16.17 0 top
RS  20.34,1 0 top
U1  15.64,20.16 270 bottom
U2  25.83,12.54 0 top
X1  21.3,21.3 0 bottom
X2  19.35,8.09 180 top
X3  23.16,18.45 180 top

### Tracks (layer width: path | path; a pad name or v marks a point on that pad's centre or on a via)
B  (via drill 0.2 pad 0.41)
  Top 0.254: v15.9,26.45 15.9,25.21 B.P$1
  Bottom 0.203: R2.2 20.45,27.86 20.32,27.73 18.06,27.73 16.79,26.45 v15.9,26.45
  Bottom 0.254: v15.9,26.45 15.9,25.21 B.P$1 16.39,24.71 U1.P$44
DCDC_SW  (via drill 0.2 pad 0.41)
  Top 0.254: U2.17 28.37,10.67 v28.37,10.22
  Bottom 0.254: 28.92,10.77 FB2.1
  Bottom 0.508: v28.37,10.22 28.92,10.77
GND  (via drill 0.2 pad 0.41, 0.25 pad 0.51, 0.3 pad 0.61, 0.36 pad 0.81)
  Top 0.203: C27.2 16.86,6.26 v17.34,5.78 18.03,5.78 18.29,6.03 C28.2
  Top 0.381: C23.1 C24.1
  Top 0.406: C25.1 11.96,14.99 v11.96,15.76
  Top 0.457: C23.1 15.8,11.44 v15.77,11.42 | C22.2 17.41,11.15 v17.24,10.99 | C11.2 30.59,12.88 v31.11,13.4 | v23.44,4.87 23.44,5.97 C13.2 24.38,6.02 C19.1 | C12.2 22.09,5.97 v22.09,5.09
  Top 0.508: X3.2 22.06,19.61 22.98,20.54 v24.05,20.54 | X3.4 24.4,17.79 25.12,17.79 25.63,18.3 25.71,18.21 C10.2 C15.2 29.24,18.21 v29.69,17.77 | C18.2 11.39,19.6 v13.31,19.6
  Top 0.61: v13.31,22.47 v14.32,22.47 | v17.9,22.47 v16.89,22.47
  Top 0.635: D1.C 10.43,26.16 v10.95,26.68
  Bottom 0.254: U1.P$47 17.89,22.41 13.31,20.64 | 13.39,16.1 U1.P$23 13.39,18.16 13.56,21.86 15.01,18.38 14.42,20.64 | v13.31,22.47 13.32,22.41 U1.P$35 8.39,22.41 7.41,23.38 7.41,23.51 | v14.32,22.47 14.63,22.44
  Bottom 0.356: X1.P$2 22.12,21.3
  Bottom 0.381: R3.1 26.58,21.57 v27.28,20.87 | 23.06,5.97 23.39,5.97 C13.2 23.43,4.88 v23.44,4.87 | 23.92,1.67 v23.77,1.82
  Bottom 0.406: C8.2 19.99,26.59 19.99,26.58 | v22.5,26 22.45,26 | P2.9 24.81,0.78 23.92,1.67 | C4.2 v5.69,14.92
  Bottom 0.457: 22.12,21.3 22.5,21.68 22.5,23.84 22.76,24.09 | C1.2 22.54,24.05 22.5,24.09 v22.5,26 | 17.89,22.41 17.71,22.41 v17.9,22.47 | v16.89,22.47 16.41,22.44 | 30.82,13.69 v31.11,13.4 | C14.2 23.06,5.97
  Bottom 0.508: 7.41,23.51 7.41,24.88 8.33,25.8 | C7.2 9.79,15.76 v11.96,15.76 | 30.82,13.69 30.82,14.7 C17.2
  Bottom 0.61: C3.2 8.33,25.8 | 22.25,23.97 22.25,24.09 22.5,24.09 22.76,24.09 23.32,24.09 C1.2 | 14.42,20.64 13.31,20.64 15.64,21.3 | v15.64,22.44 14.63,22.44
  Bottom 0.635: v10.95,26.68 C6.2
  other vias: 19.89,26.58 25.83,12.54 25.83,13.78 24.61,13.78 24.61,12.54 24.61,11.32 25.83,11.32 27.05,11.32 27.02,12.51 27.02,13.78 6.98,11.47 8.1,11.93 6.04,8.88 6.65,7.81 9.57,6.87 10.69,7.48 11.4,12.56 12.72,10.53 14.32,10.12 14.81,8.47 2.26,12.82 3.05,11.44 5.13,7.86 7.16,4.26 7.87,2.91 9.04,4.23 11.15,5.53 10.92,3.54 13.87,5.27 12.8,6.69 14.5,3.65 14.96,6.26 6.75,12.92 5.23,12.87 3.73,12.56 12.6,3.9 15.9,2.71 13.41,2.45 12.11,0.95 14.4,0.95 16.25,4.61 2.36,17.49 3.17,18.81 6.25,24.37 12.49,29.27 14.12,29.22 20.19,29.38 22.4,29.4 26.87,26.56 27.53,25.26 26.01,25.44 23.92,26.71 32.15,17.84 32.26,12.16
  pour Bottom (no thermals): 0.05,15 8.68,29.99 25.96,29.99 34.59,15 25.96,0.01 8.68,0.01
  pour Route2: 8.73,29.88 25.88,29.88 26.9,28.16 27.05,27.9 27.35,27.37 28.45,25.46 34.49,15 25.91,0.14 8.73,0.14 0.15,15
  pour Top (no thermals): 8.68,29.99 0.05,15 8.68,0.01 25.96,0.01 34.59,15 25.96,29.99
N$1  (via drill 0.2 pad 0.41, 0.36 pad 0.81)
  Top 0.203: 6.2,19.29 7.95,19.29 9.04,20.39 9.04,21.1 v9.45,21.5
  Top 0.254: v5.81,18 5.81,18.91 6.2,19.29
  Top 0.406: v5.81,18 D.P$1
  Bottom 0.203: v9.45,21.5 9.85,21.91 U1.P$34
  Bottom 0.406: D.P$1 v5.81,18
N$2  (via drill 0.2 pad 0.41, 0.36 pad 0.81)
  Top 0.203: v12.9,24.98 12.9,27.14 12.29,27.75 10.56,27.75 9.68,26.86 8.28,26.86 6.98,25.57 v6.98,21.63
  Top 0.508: C.P$1 6.98,20.61 v6.98,21.63
  Bottom 0.203: v12.9,24.98 U1.P$37
  Bottom 0.406: v6.98,21.63 6.98,20.54 C.P$1
N$3
  Top 0.203: RO.P$1 26.62,3.85 26.62,6.95 27.3,7.63 27.3,8.85 27.08,9.08 U2.15
N$5
  Top 0.457: L6.2 17.41,14.26 | 17.41,14.26 C21.1 | 17.41,14.26 16.79,14.26 16.05,15 L4.1 15.8,14.93 C23.2
N$6
  Top 0.203: 24.52,7.44 C19.2 | 24.84,7.62 C19.2 | U2.12 25.58,9.11 24.69,8.22 24.69,7.47 C19.2
N$7
  Top 0.203: 22.25,1 RK.P$1 22.27,2.07 24.76,4.56 25.45,4.56 25.93,5.04 25.93,7.32 26.29,7.67 26.52,7.67 26.83,7.99 26.83,8.66 26.58,8.92 26.58,9.14 U2.14
N$8  (via drill 0.2 pad 0.41)
  Top 0.254: 10.55,22.33 10.55,21.19 v10.56,21.17
  Top 0.406: R1.2 10.55,22.33
  Bottom 0.203: U1.P$32 10.82,20.92 v10.56,21.17
  Bottom 0.254: U1.P$32
N$9  (via drill 0.2 pad 0.41)
  Top 0.203: U2.13 26.08,8.93 v26.08,8.35 | 20.34,1.11 RS.P$1
  Top 0.254: 20.34,1.11 v21.28,2.05
  Bottom 0.152: v26.08,8.35 26.08,4.99 24.25,3.16 22.4,3.16 21.64,2.4
  Bottom 0.203: 21.31,2.07 21.64,2.4
  Bottom 0.254: 21.31,2.07 v21.28,2.05
N$10
  Top 0.635: R1.1 8.85,25.29 D1.A
N$11
  Top 0.457: C24.2 14.56,13.6 L4.2 L5.1
N$12
  Top 0.457: C29.2 13.26,12.21 L5.2 C25.2
N$13
  Top 0.457: C29.1 P1.1
N$14
  Bottom 0.254: U1.P$5 19.57,20.91 19.84,21.17 19.84,22.06 20.22,22.44 21.24,22.44 X1.P$1
N$15
  Bottom 0.254: U1.P$6 20.22,20.41 20.47,20.16 21.24,20.16 X1.P$3
N$16
  Top 0.152: U2.4 22.65,12.79 21.84,11.98 21.49,11.98 21.03,11.52 21.03,10.83 18.6,8.41 X2.P$2
  Top 0.203: C27.1 18.29,8.41 X2.P$2
N$17
  Top 0.152: U2.5 22.7,12.28 22.04,11.62 21.87,11.62 21.43,11.19 21.43,10.61 20.1,9.27 X2.P$1 20.1,6.12 C28.1 20.23,6.12
  Top 0.203: U2.5
N$18
  Top 0.203: U2.30 25.08,15.95 24.64,16.4 23.47,16.4 23.16,16.7 23.16,19.01 23.42,19.27 24.25,19.27 X3.1
N$19
  Top 0.203: X3.3 22.06,17.09 23.24,15.91 24.3,15.91 24.58,15.63 U2.31
N$20
  Top 0.203: U2.16 27.58,9.28 27.8,9.06 27.8,7.24 27.25,6.69 27.25,5.8 RI.P$1
N$22
  Top 0.254: U2.2 21.45,13.79 L2.1 21.12,13.54 20.93,13.73 20.28,13.73 L1.1 19.94,13.43 19.78,13.58 18.76,13.58 C21.2
N$24
  Top 0.254: U2.1 21.76,14.29 L2.2 20.21,14.84 C20.1 19.87,15.11 19.68,14.92 18.78,14.92 L6.1
R  (via drill 0.36 pad 0.81)
  Top 0.254: v25.19,22.75 25.32,22.62 25.32,21.02 26.62,19.72 R.P$1
  Bottom 0.203: U1.P$7 20.09,19.91 20.42,19.57 22.3,19.57 22.58,19.85 22.58,20.13
  Bottom 0.254: v25.19,22.75 25.23,22.61 26.88,22.61 28.22,21.27 28.22,19.8 R.P$1 | 22.58,20.13 22.58,20.41 23.89,21.72 C1.1
  Bottom 0.457: R.P$1 28.55,19.72 28.8,19.47
  Bottom 0.508: C1.1 24.85,22.41 v25.19,22.75
RF_DIO_2  (via drill 0.2 pad 0.41)
  Top 0.152: U2.8 23.4,9.64 22.74,8.98 21.56,8.98 20.93,8.35 20.93,5.02 v20.5,4.59
  Bottom 0.152: v20.5,4.59 20.11,4.59 19.84,4.87 19.84,9.44 19.43,9.84 16.25,9.84 14.55,11.55 14.55,14.06 13.59,15.03 8.63,15.03 7.82,14.21 5.2,14.21 4.24,15.18 4.24,17.72 5.28,18.76 10.23,18.76 10.79,18.2
  Bottom 0.203: U1.P$26 11.09,17.91 10.79,18.2
RF_DIO_3  (via drill 0.2 pad 0.41)
  Top 0.152: U2.9 24.08,9.31 23.34,8.57 22.53,8.57 22.45,8.65 21.77,8.65 21.28,8.17 21.28,4.28 20.88,3.88 19.78,3.88 v19.38,4.28
  Bottom 0.152: v19.38,4.28 19.38,9.08 19.02,9.44 16.02,9.44 14.09,11.37 14.09,13.93 13.36,14.67 8.86,14.67 7.97,13.78 4.92,13.78 3.76,14.95 3.76,17.72 5.15,19.11 10.66,19.11 11.15,18.63
  Bottom 0.203: U1.P$27 11.37,18.41 11.15,18.63
RF_RESET  (via drill 0.2 pad 0.41)
  Top 0.152: U2.19 28.96,11.79 29.16,11.98 29.16,14.52 30.35,15.71 | 29.56,20.26 29.56,19.29 29.92,18.94 30.93,18.94 31.37,18.5 31.37,18
  Top 0.203: v11.35,17.29 11.47,17.41 U1.P$25 12.25,17.46 17.4,17.46 21.33,21.4 22.73,21.4 23.44,22.11 23.44,23.2 24.15,23.91 26.44,23.91 27.2,23.15 27.2,22.16 28.67,20.69 29.13,20.69 29.56,20.26 | 31.37,18 31.37,16.73 30.35,15.71
  Top 0.254: v11.35,17.29 10.43,18.21 R7.1 10.06,19.61 C18.1 9.27,19.62 8.66,19.01 8.66,17.08 7.85,16.27 7.54,16.27
  Top 0.381: RR.P$1 6.5,16.27 7.54,16.27
  Bottom 0.152: U1.P$25 11.47,17.41 v11.35,17.29
RX_TX
  Top 0.254: U2.3 23.39,13.27 22.45,13.27 21.69,12.51 21.13,12.51 20.71,12.09 L1.2 18.75,12.09 C22.1
USART1_RX
  Bottom 0.152: U1.P$31 8.81,20.41 8.56,20.66 8.56,21.4 7.44,22.52
  Bottom 0.254: U1.P$31
  Bottom 0.406: 7.44,22.52 5.49,22.52 P2.23
USART1_TX  (via drill 0.36 pad 0.81)
  Top 0.381: 4.84,22.08 P2.17
  Top 0.457: 4.62,21.86 4.37,21.6 | 4.84,22.08 4.62,21.86 | 4.62,21.86 v4.62,20.08
  Bottom 0.152: U1.P$30 11.03,19.91 10.61,19.5 5.2,19.5 v4.62,20.08
  Bottom 0.254: U1.P$30
USART2_RX
  Bottom 0.152: 21.71,11.6 22.38,10.94 23.21,10.94 23.92,10.22 24.66,10.22 25.14,9.74
  Bottom 0.203: 18.39,15.88 18.39,13.88 19.91,12.36 20.95,12.36 21.71,11.6 | 25.14,9.74 26.41,9.74 27.76,8.4
  Bottom 0.254: U1.P$13 18.39,15.88
  Bottom 0.508: 29.37,7.88 P2.20 28.27,7.88 27.76,8.4
USART2_TX  (via drill 0.2 pad 0.41)
  Top 0.508: v28.7,9.26 29.65,8.31 P2.14
  Bottom 0.152: 22.53,11.47 23.34,11.47 24.18,10.63 24.86,10.63 25.3,10.2
  Bottom 0.203: 19.09,16.2 19.09,13.91 20.14,12.87 21.13,12.87 22.53,11.47 | 25.3,10.2 26.79,10.2 27.73,9.26 v28.7,9.26
  Bottom 0.254: U1.P$12 19.09,16.2
USART3_RX  (via drill 0.2 pad 0.41)
  Top 0.152: U2.7 22.95,11.29 22.91,11.29 22.48,10.86 v22.48,9.59
  Bottom 0.203: U1.P$22 13.89,15.48 18.95,10.43 19.84,10.43 20.44,9.82 20.44,9.23 20.93,8.75 21.64,8.75 v22.48,9.59
USART3_TX  (via drill 0.2 pad 0.41)
  Top 0.152: U2.6 22.79,11.79 21.87,10.86 21.87,9.95 v21.49,9.56
  Bottom 0.203: U1.P$21 14.39,15.62 19.15,10.86 20.14,10.86 21.38,9.62 v21.49,9.56
USART4_RX
  Bottom 0.152: 25.93,14.9 27.68,14.9 27.91,15.13 27.91,15.84 28.11,16.04 28.11,16.47 28.32,16.68 30.2,16.68 30.25,16.73
  Bottom 0.203: U1.P$11 19.59,17.91 19.91,17.59 19.91,16.12 20.67,15.36 21.84,15.36 22.73,14.47 24.15,14.47 24.58,14.9 25.93,14.9 | 30.78,20.44 31.04,20.18 31.04,17.52 30.25,16.73
  Bottom 0.254: 29.66,22.07 P2.19
  Bottom 0.406: 30.78,20.44 29.65,21.57 P2.19
USART4_TX  (via drill 0.2 pad 0.41)
  Top 0.381: P2.13 30.3,21.43 v30.3,19.6
  Bottom 0.152: 24.51,15.86 24.84,15.86 25.35,15.36 27.23,15.36 27.48,15.61 27.48,15.99 27.71,16.22 27.71,16.78 28.04,17.11 30,17.11
  Bottom 0.203: U1.P$10 19.73,18.41 20.5,17.64 20.5,17.36 | 20.5,16.45 21.08,15.86 24.51,15.86 | v30.3,19.6 30.3,18.91 30.55,18.66 30.55,17.67 30,17.11
  Bottom 0.254: 20.5,17.62 20.5,17.36 20.5,16.45
USART5_RX
  Bottom 0.254: U1.P$40 14.39,24.19 | 14.4,24.2 14.39,24.19 | 14.39,24.19 14.39,26.22 15.92,27.75
  Bottom 0.406: 15.92,27.75 P2.25
USART5_TX  (via drill 0.2 pad 0.41)
  Top 0.203: 17.02,29.18 P2.18
  Top 0.406: v14.25,27.45 15.62,27.45 P2.18
  Bottom 0.203: U1.P$39 13.89,27.09 v14.25,27.45
  Bottom 0.254: U1.P$39
USART6_RX
  Bottom 0.152: 21.21,10.55 21.56,10.2 22.81,10.2 23.59,9.41 24.08,9.41 24.61,8.88 | 17.95,3.44 18.18,3.67 19.91,3.67 20.11,3.88 21.23,3.88 21.49,4.13 23.7,4.13 24.61,5.04
  Bottom 0.203: U1.P$15 17.39,13.43 19.45,11.37 20.39,11.37 21.21,10.55 | 24.61,8.88 24.61,5.04 | 17.95,3.44 17.32,2.81
  Bottom 0.381: 17.32,0.81 P2.21
  Bottom 0.406: 17.32,0.81 17.35,0.81
  Bottom 0.457: 17.32,2.81 17.32,0.81
USART6_TX  (via drill 0.36 pad 0.81)
  Top 0.381: 17.35,1.31 P2.15
  Top 0.457: 17.35,1.31 v18.59,2.55
  Bottom 0.152: 21.51,11.04 21.54,11.04 22.02,10.55 23.04,10.55 23.77,9.82 24.36,9.82 25.14,9.03 | 25.14,4.76 24.08,3.7 21.74,3.7 21.43,3.39 20.32,3.39 20.16,3.24 19.28,3.24 18.97,2.94
  Bottom 0.203: U1.P$14 17.89,13.61 19.68,11.82 20.72,11.82 21.51,11.04 | 25.14,4.76 25.14,9.03 | 18.97,2.94 v18.59,2.55
VDD  (via drill 0.2 pad 0.41, 0.3 pad 0.61, 0.36 pad 0.81)
  Top 0.152: U2.28 26.08,15.45 26.67,16.04 v26.79,16.04
  Top 0.203: C13.1 23.12,7.38 | v22.09,8.02 22.09,7.36 C12.1 C13.1 | U2.11 25.08,9.37 23.43,7.72 C13.1
  Top 0.254: U2.18 29.78,11.29 C11.1 | v26.79,16.04 27.15,16.4 C10.1
  Top 0.381: 27.23,16.84 C10.1
  Top 0.508: v31.06,11.57 C11.1 | P2.1 25.65,29.28 v25.65,27.19 | P2.6 9.85,29.18 9.85,28.95 9.7,28.95 9.7,28.74 v11.2,28.74 | P2.5 2.08,14.98 v2.64,14.42 | R7.2 9.46,15.91 8.63,15.91 7.67,14.95 v7.54,14.95
  Top 0.635: P2.4 9.78,0.78 v10.87,1.87 | P2.3 25.55,1.92 v24.86,2.6 | P2.2 33.65,14.85 v32.36,13.55
  Bottom 0.203: 10.97,16.52 12.06,16.52 12.24,16.71 U1.P$24
  Bottom 0.254: C6.1 10.95,23.08 11.12,22.91 U1.P$36 11.88,22.91 11.83,22.95 11.83,23.2 | C9.1 20.51,23.75 19.71,22.95 19.14,22.95 U1.P$1 19.09,23.56 v19.07,23.59 19.05,23.61 U1.P$48 18.39,24.47 C8.1 | U1.P$24 12.78,16.71
  Bottom 0.381: C3.1 9.02,24.04 8.63,24.04 | 10.97,16.52 9.81,17.68 C7.1 | FB1.2 27.59,17.67 26.79,16.88 v26.79,16.04
  Bottom 0.457: C14.1 23.23,8.02 v22.09,8.02
  Bottom 0.508: v7.54,14.95 7.54,15.88 C4.1
  Bottom 0.61: C6.1 10.95,23.33 10.82,23.2 | 11.83,23.2 12.09,23.46 v12.09,23.97
  Bottom 0.635: C7.1 9.18,17.68 8.02,16.52 7.93,16.52 C4.1 | C3.1 9.16,24.13 9.65,23.64 10.93,23.64 C6.1
  pour Route15 (rank 2): 8.73,29.86 8.23,28.97 0.17,15.03 8.73,0.14 25.91,0.14 34.47,15 25.91,29.86
VDDA
  Bottom 0.254: U1.P$9 19.92,18.91 21.81,17.01 C5.1
  Bottom 0.406: 24.18,17.14 24.56,17.52 24.96,17.52 25.6,18.15 FB1.1
  Bottom 0.61: 24.18,17.14 C2.1 23.22,17.01 21.89,17.01 C5.1
VPP  (via drill 0.2 pad 0.41)
  Top 0.203: U2.29 25.58,15.92 v25.8,16.14 25.8,16.84 C16.1 25.91,16.89
  Top 0.254: U2.32 23.66,14.96 v23.42,15.2
  Top 0.381: C15.1 29.03,16.38 v29.03,16.02
  Bottom 0.381: C17.1 29.09,15.95 v29.03,16.02
  Bottom 0.635: C17.1 29.09,13.12 FB2.2
  pour Route15: 21.71,14.03 26.51,14.03 26.51,17.08 28.22,17.08 28.22,15.15 30.15,15.15 30.15,18.81 21.71,18.81
VSSA
  Bottom 0.203: U1.P$8 20.03,19.41 20.39,19.04 21.61,19.04 C5.2
  Bottom 0.508: C5.2 23.96,18.61 C2.2 24.77,19.77 26.06,19.77
  Bottom 0.61: C2.2 23.54,19.04 | 26.06,19.77 R3.2

### Text on the board
tNames: 3V3 | 3V3 | P5 | P1 | P4 | 3V3 | 3V3 | P2* | 3V3 | P3 | 3V3
bNames: GND | P5 | B | GND | P1 | P4 | C | R | D | GND | GND | H1FR00 | P2* | P3 | GND | GND
LayerStack: Total Thickness 1.6 mm / --------------------------------------------------------- / / copper_top_l1.gbr : Top Conductor - Copper: Thickness 0.035 mm / / Dielectric - FR-4: Thickness 0.175 mm / / copper_inner_l2.gbr : GND Plane - Copper: Thickness 0.035 mm / / Dielectric - FR-4: Thickness 1.11 mm / / copper_inner_l3.gbr : VDD Plane - Copper: Thickness 0.035 mm / / Dielectric - FR-4: Thickness 0.175 mm / / copper_bottom_l4.gbr : Bottom Conductor - Copper: Thickness 0.035 mm